# Altium schematic sheet LTEW_WPC_RCVR.SchDoc: LTEW_WPC_RCVR
size A4; DrawnBy: Tristan Traiber; Engineer: Tristan Traiber; Organization: MSE HES-SO; Address1: HEVS; Address3: Tristan Traiber; DocumentNumber: 4; Revision: 1.0; SheetNumber: 4; SheetTotal: 6
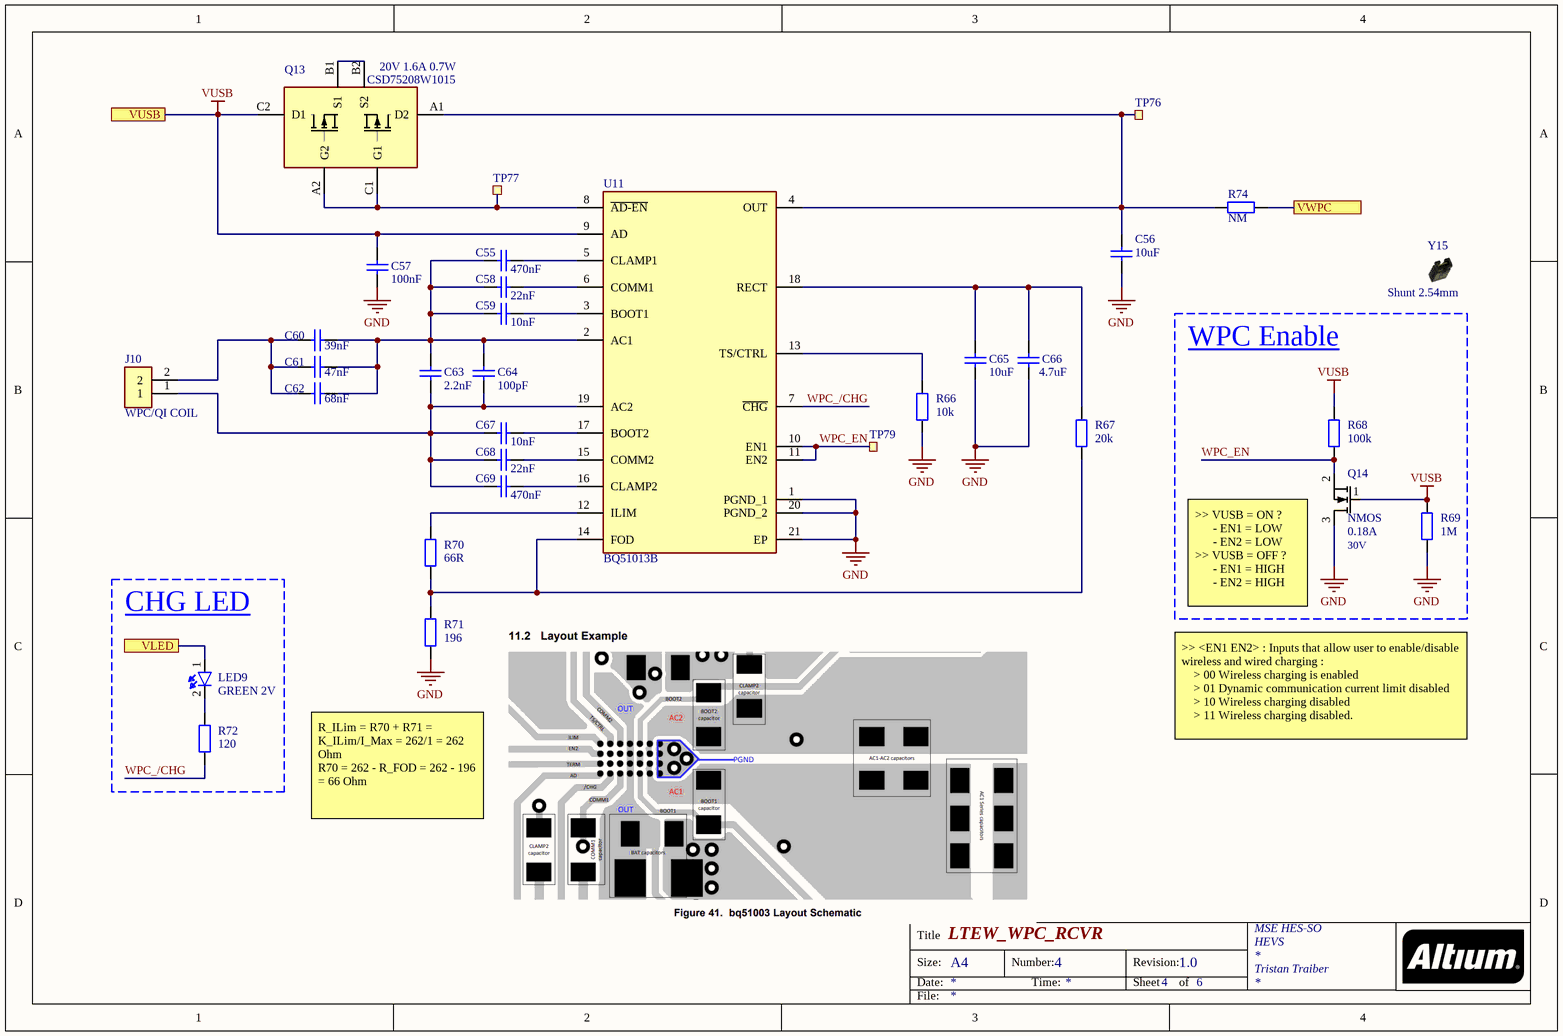
[diagram p0: LTEW_WPC_RCVR.SchDoc]

## Parts
C55  470nF  [C0603]
C56  10uF  [C0603]
C57  100nF  [C0603]
C58  22nF  [C0603]
C59  10nF  [C0603]
C60  39nF  [C0603]
C61  47nF  [C0603]
C62  68nF  [C0603]
C63  2.2nF  [C0603]
C64  100pF  [C0603]
C65  10uF  [C0603]
C66  4.7uF  [C0603]
C67  10nF  [C0603]
C68  22nF  [C0603]
C69  470nF  [C0603]
J10  WPC/QI COIL  [23839422]
LED9  GREEN 2V  [LEDC1608X80N]
Q13  20V 1.6A 0.7W  Manufacturer_Part_Number: CSD75208W1015  [BGA6C50P2X3_95X145X62]
Q14  NMOS  value 30V  Value2: 0.18A  [SOT65P210X110-3N]
R66  10k  [RES0603]
R67  20k  [RES0603]
R68  100k  [RES0603]
R69  1M  [RES0603]
R70  66R  [RES0603]
R71  196  [RES0603]
R72  120  [RES0603]
R74  NM  [RES0603]
TP76  Ø1.0mm,SMD  [TP_SMD_Ø0.8mm]  (value not drawn)  (no BOM)
TP77  Ø1.0mm,SMD  [TP_SMD_Ø0.8mm]  (value not drawn)  (no BOM)
TP79  Ø1.0mm,SMD  [TP_SMD_Ø0.8mm]  (value not drawn)  (no BOM)
U11  BQ51013B  [BQ51050BRHLR]
Y15  Shunt 2.54mm  [Shunt_2.54mm_Horizontal]

## Blocks framed on the sheet
WPC Enable: Q14 R68 R69
CHG LED: LED9 R72

## Ports
VLED, VUSB, VWPC

## Nets
GND: C56.1 C57.1 C65.1 C66.1 Q14.3(D) R66.1 R69.1 R71.1 U11.1(PGND_1) U11.20(PGND_2) U11.21(EP)
VUSB: C57.2 Q13.C2(D1) Q14.1(G) R68.2 R69.2 U11.9(AD) ; port VUSB
VLED: LED9.1(A) ; port VLED
VWPC: R74.1 ; port VWPC
WPC_/CHG: R72.1 U11.7(~{CHG})
WPC_EN: Q14.2(S) R68.1 TP79.1 U11.10(EN1) U11.11(EN2)
NetC55_1: C55.1 C58.1 C59.1 C60.2 C61.2 C62.2 C63.2 C64.2 U11.2(AC1)
NetC55_2: C55.2 U11.5(CLAMP1)
NetC56_2: C56.2 Q13.A1(D2) R74.2 TP76.1 U11.4(OUT)
NetC58_2: C58.2 U11.6(COMM1)
NetC59_2: C59.2 U11.3(BOOT1)
NetC60_1: C60.1 C61.1 C62.1 J10.2
NetC63_1: C63.1 C64.1 C67.1 C68.1 C69.1 J10.1 U11.19(AC2)
NetC65_2: C65.2 C66.2 R67.2 U11.18(RECT)
NetC67_2: C67.2 U11.17(BOOT2)
NetC68_2: C68.2 U11.15(COMM2)
NetC69_2: C69.2 U11.16(CLAMP2)
NetLED9_2: LED9.2(K) R72.2
NetQ13_A2: Q13.A2(G2) Q13.C1(G1) TP77.1 U11.8(~{AD-EN})
NetQ13_B1: Q13.B1(S1) Q13.B2(S2)
NetR66_2: R66.2 U11.13(TS/CTRL)
NetR67_1: R67.1 R70.1 R71.2 U11.14(FOD)
NetR70_2: R70.2 U11.12(ILIM)

## Notes on the sheet
- (near Q14) >> VUSB = ON ?
  - EN1 = LOW
  - EN2 = LOW
  >> VUSB = OFF ?
  - EN1 = HIGH
  - EN2 = HIGH
- >> <EN1 EN2> : Inputs that allow user to enable/disable wireless and wired charging :
  > 00 Wireless charging is enabled
  > 01 Dynamic communication current limit disabled
  > 10 Wireless charging disabled
  > 11 Wireless charging disabled.
- R_ILim = R70 + R71 = K_ILim/I_Max = 262/1 = 262 Ohm
  R70 = 262 - R_FOD = 262 - 196 = 66 Ohm
- Title
- Size:
- Date:
- A4
- Number:
- Time:
- Revision:
- Sheet
- of
- File:

## Library data of the parts
C55 C69 = C_470n: 0.47 µF ±10% 25V Ceramic Capacitor X7R 0603 (1608 Metric); Manufacturer_Part_Number: GRM188R71E474KA12D; Manufacturer_Name: Murata Electronics; Value: 470nF; Supplier 1: Digi-Key; Supplier Part Number 1: 490-3291-1-ND; Unit Price: 0.17
C56 C65 = C_10u: 10 µF ±10% 25V Ceramic Capacitor X5R 0805 (2012 Metric); Manufacturer_Part_Number: GRM188R61E106KA73J; Manufacturer_Name: Murata Electronics; Supplier 1: Mouser; Value: 10uF; Supplier Part Number 1: 81-GRM188R61E106KA3J; Unit Price: 0.280
C57 = C_100n: 0.1 µF ±10% 25V Condensateurs céramique X7R 0603 (1608 métrique); Manufacturer_Part_Number: CL10B104KA8NNNC; Manufacturer_Name: Samsung Electro-Mechanics; Supplier 1: Digi-Key; Value: 100nF; Supplier Part Number 1: 1276-1006-1-ND; Unit Price: 0.10
C58 C68 = C_22n: 0.022 µF ±10% 25V Ceramic Capacitor X7R 0603 (1608 Metric); Manufacturer_Part_Number: C0603C223K3RAC7867; Manufacturer_Name: KEMET; Value: 22nF; Supplier 1: Digi-Key; Supplier Part Number 1: 399-C0603C223K3RAC7867CT-ND; Unit Price: 0.100
C59 C67 = C_10n: 10000 pF ±5% 25V Condensateurs céramique C0G, NP0 0603 (1608 métrique); Manufacturer_Part_Number: C1608C0G1E103J080AA; Manufacturer_Name: TDK Corporation; Value: 10nF; Supplier 1: Digi-Key; Supplier Part Number 1: 445-2664-1-ND; Unit Price: 0.270
C60 = C_39n: 0.039 µF ±10% 50V Ceramic Capacitor X7R 0603 (1608 Metric); Manufacturer_Part_Number: 0603B393K500CT; Manufacturer_Name: Walsin Technology Corporation; Value: 39nF; Unit Price: 0.10; Supplier 1: Digi-Key; Supplier Part Number 1: 1292-1436-1-ND
C61 = C_47n: 0.047 µF ±10% 25V Ceramic Capacitor X7R 0603 (1608 Metric); Manufacturer_Part_Number: 06033C473KAT2A; Manufacturer_Name: KYOCERA AVX; Value: 47nF; Unit Price: 0.10; Supplier 1: Digi-Key; Supplier Part Number 1: 478-1235-6-ND
C62 = C_68n: 0.068 µF ±10% 25V Ceramic Capacitor X7R 0603 (1608 Metric); Manufacturer_Part_Number: 0603B683K250CT; Manufacturer_Name: Walsin Technology Corporation; Value: 68nF; Unit Price: 0.10; Supplier 1: Digi-Key; Supplier Part Number 1: 1292-1462-1-ND
C63 = C_2.2n: 2200 pF ±5% 25V Ceramic Capacitor X7R 0603 (1608 Metric); Manufacturer_Part_Number: 06033C222JAT2A; Manufacturer_Name: KYOCERA AVX; Value: 2.2nF; Unit Price: 0.10; Supplier 1: Digi-Key; Supplier Part Number 1: 478-12683-1-ND
C64 = C_100p: 100 pF ±5% 25V Ceramic Capacitor C0G, NP0 0603 (1608 Metric); Manufacturer_Part_Number: 06033A101JAT2A; Manufacturer_Name: KYOCERA AVX; Value: 100pF; Unit Price: 0.10; Supplier 1: Digi-Key; Supplier Part Number 1: 478-06033A101JAT2ACT-ND
C66 = C_4.7u: 4.7 µF ±10% 25V Condensateurs céramique X6S 0603 (1608 métrique); Manufacturer_Part_Number: GRM188C81E475KE11D; Manufacturer_Name: Murata Electronics; Supplier 1: Digi-Key; Value: 4.7uF; Supplier Part Number 1: 490-7199-1-ND; Unit Price: 0.24
J10 = CONN_WPC_IND: 2 Position Wire to Board Terminal Block Horizontal with Board 0.138" (3.50mm) Surface Mount; Manufacturer_Name: TE Connectivity; Manufacturer_Part_Number: 2383942-2; Datasheet Link: https://www.te.com/commerce/DocumentDelivery/DDEController?Action=showdoc&DocId=Customer+Drawing%7F2383942%7FA1%7Fpdf%7FEnglish%7FENG_CD_2383942_A1.pdf%7F2383942-2; Height: 8.65mm; Supplier 1: Digi-Key; Supplier Part Number 1: 17-2383942-2CT-ND; Unit Price: 2.77
LED9 = LED_G: Green 570nm LED Indication - Discrete 2V 0603 (1608 Metric); Manufacturer_Name: QT Brightek (QTB); Manufacturer_Part_Number: 150060VS75000; Datasheet Link: http://www.qt-brightek.com/datasheet/QBLP617_series.pdf; Height: 1.3mm; Supplier 1: Digi-Key; Supplier Part Number 1: 732-4980-1-ND; Unit Price: 0.15
Q13 = MOS_2PCH: Mosfet Array 2 P-Channel (Dual) Common Source 20V 1.6A 750mW Surface Mount 6-DSBGA (1x1.5); Manufacturer_Name: Texas Instruments; Datasheet Link: http://www.ti.com/lit/ds/symlink/csd75208w1015.pdf; Height: 0.625mm; Value: 20V 1.6A 0.7W; Supplier 1: Digi-Key; Supplier Part Number 1: 296-38339-1-ND; Unit Price: 0.60
Q14 = MOS-N: N-Channel 30 V 180mA (Ta) 260mW (Ta), 1.1W (Tc) Surface Mount SOT-323; Manufacturer_Name: NXP; Manufacturer_Part_Number: NX3020NAKW; Datasheet Link: https://datasheetspdf.com/pdf-file/1379402/nexperia/NX3020NAKW/1; Height: 1.1mm; Supplier 1: Digi-Key; Supplier Part Number 1: 1727-1288-1-ND; Unit Price: 0.30
R66 = R_10k: 10 kOhms ±1% 0.1W, 1/10W Chip Resistor 0603 (1608 Metric) Moisture Resistant Thick Film; Manufacturer_Part_Number: RC0805FR-0710KL; Manufacturer_Name: YAGEO; Value: 10k; Supplier 1: Digi-Key; Supplier Part Number 1: 311-10.0KHRCT-ND; Unit Price: 0..10
R67 = R_20k: 20 kOhms ±1% 0.1W, 1/10W Chip Resistor 0603 (1608 Metric) Moisture Resistant Thick Film; Manufacturer_Part_Number: RC0805FR-0710KL; Manufacturer_Name: YAGEO; Value: 20k; Supplier 1: Digi-Key; Supplier Part Number 1: 311-20.0KHRCT-ND; Unit Price: 0.10
R68 = R_100k: RES SMD 100K OHM 1% 1/8W 0603; Manufacturer_Part_Number: RC0805FR-07100KL; Manufacturer_Name: YAGEO; Supplier 1: Digi-Key; Supplier Part Number 1: 311-100KCRCT-ND; Value: 100k; Unit Price: 0.10
R69 = R_1M: 1 MOhms ±1% 0.1W, 1/10W Chip Resistor 0603 (1608 Metric) Automotive AEC-Q200 Thick Film; Manufacturer_Part_Number: ERJ-3EKF1004V; Manufacturer_Name: YAGEO; Value: 1M; Supplier 1: Digi-Key; Supplier Part Number 1: P1.00MHCT-ND; Unit Price: 0.10
R70 = R_66: 66.5 Ohms ±1% 0.1W, 1/10W Chip Resistor 0603 (1608 Metric) Moisture Resistant Thick Film; Manufacturer_Part_Number: RC0603FR-0766R5L; Manufacturer_Name: YAGEO; Value: 66R; Unit Price: 0.10; Supplier 1: Digi-Key; Supplier Part Number 1: 311-66.5HRCT-ND
R71 = R_196: 196 Ohms ±1% 0.1W, 1/10W Chip Resistor 0603 (1608 Metric) Moisture Resistant Thick Film; Manufacturer_Part_Number: RC0603FR-07196RL; Manufacturer_Name: YAGEO; Value: 196; Supplier 1: Digi-Key; Supplier Part Number 1: 311-196HRDKR-ND; Unit Price: 0.10
R72 = R_120: 1 MOhms ±1% 0.1W, 1/10W Chip Resistor 0603 (1608 Metric) Automotive AEC-Q200 Thick Film; Manufacturer_Part_Number: CRGCQ0603F120R; Manufacturer_Name: YAGEO; Value: 120; Supplier 1: Digi-Key; Supplier Part Number 1: A129677CT-ND; Unit Price: 0.10
R74 = R_8.66M: 8.66 MOhms ±1% 0,1W, 1/10W Pavé résistif 0603 (1608 métrique) AutomobileAEC-Q200 Couche épaisse; Manufacturer_Part_Number: CRCW06038M66FKEA; Manufacturer_Name: YAGEO; Value: NM; Supplier 1: Digi-Key; Supplier Part Number 1: 541-8.66MHCT-ND; Unit Price: 0.10
TP76 TP77 TP79 = TP_SMD: 0.8 mm circular SMD testpad; Part Number: TP_SMD_Ø1.0MM; Manufacturer: Nordic Semiconductor; Manufacturer Part Number: N.A.; Pad Count: 1; ComponentLink1URL: N.A.; ComponentLink1Description: Datasheet; ComponentLink2URL: N.A.; ComponentLink2Description: Supplier link; HelpURL: N.A.; Footprint Doc: TP_SMD_Ø1.0mm; LatestRevisionDate: 2013-06-11; Published: 2013-06-11; Value: Ø1.0mm,SMD; Note: N.A.; Artikkelnr Noca: N.A.; Part number IPS: N.A.; Supplier 1: N.A.; Supplier Part Number 1: N.A.; Supplier 2: N.A.; Supplier Part Number 2: N.A.; PartId: 100500475; Component Class: Connectors
U11 = IC_WPC_VQFN: Wireless Power Receiver PMIC 20-VQFN (3.5x4.5); Manufacturer_Name: Texas Instruments; Manufacturer_Part_Number: BQ51013BRHLR; Datasheet Link: http://www.ti.com/lit/ds/symlink/bq51013b.pdf; Unit Price: 3.9; Supplier 1: Mouser; Supplier Part Number 1: 595-BQ51013BRHLR
Y15 = SHUNT JUMPER 2.54mm BLACK GOLD Horizontal: Shunt Jumper 2.54mm Black; Manufacturer Part Number: SPC02SYAN; Manufacturer_Name: Sullins Connector Solutions; ComponentLink1URL: N.A.; ComponentLink1Description: Datasheet; ComponentLink2URL: N.A.; ComponentLink2Description: Supplier link; Footprint Doc: SHUNT JUMPER 2.54mm; Value: Shunt 2.54mm; Component Class: Connectors; Supplier 1: Digi-Key; Supplier Part Number 1: S9001-ND; Unit Price: 0.10